# EAGLE design microcondsk (EAGLE 6.3)
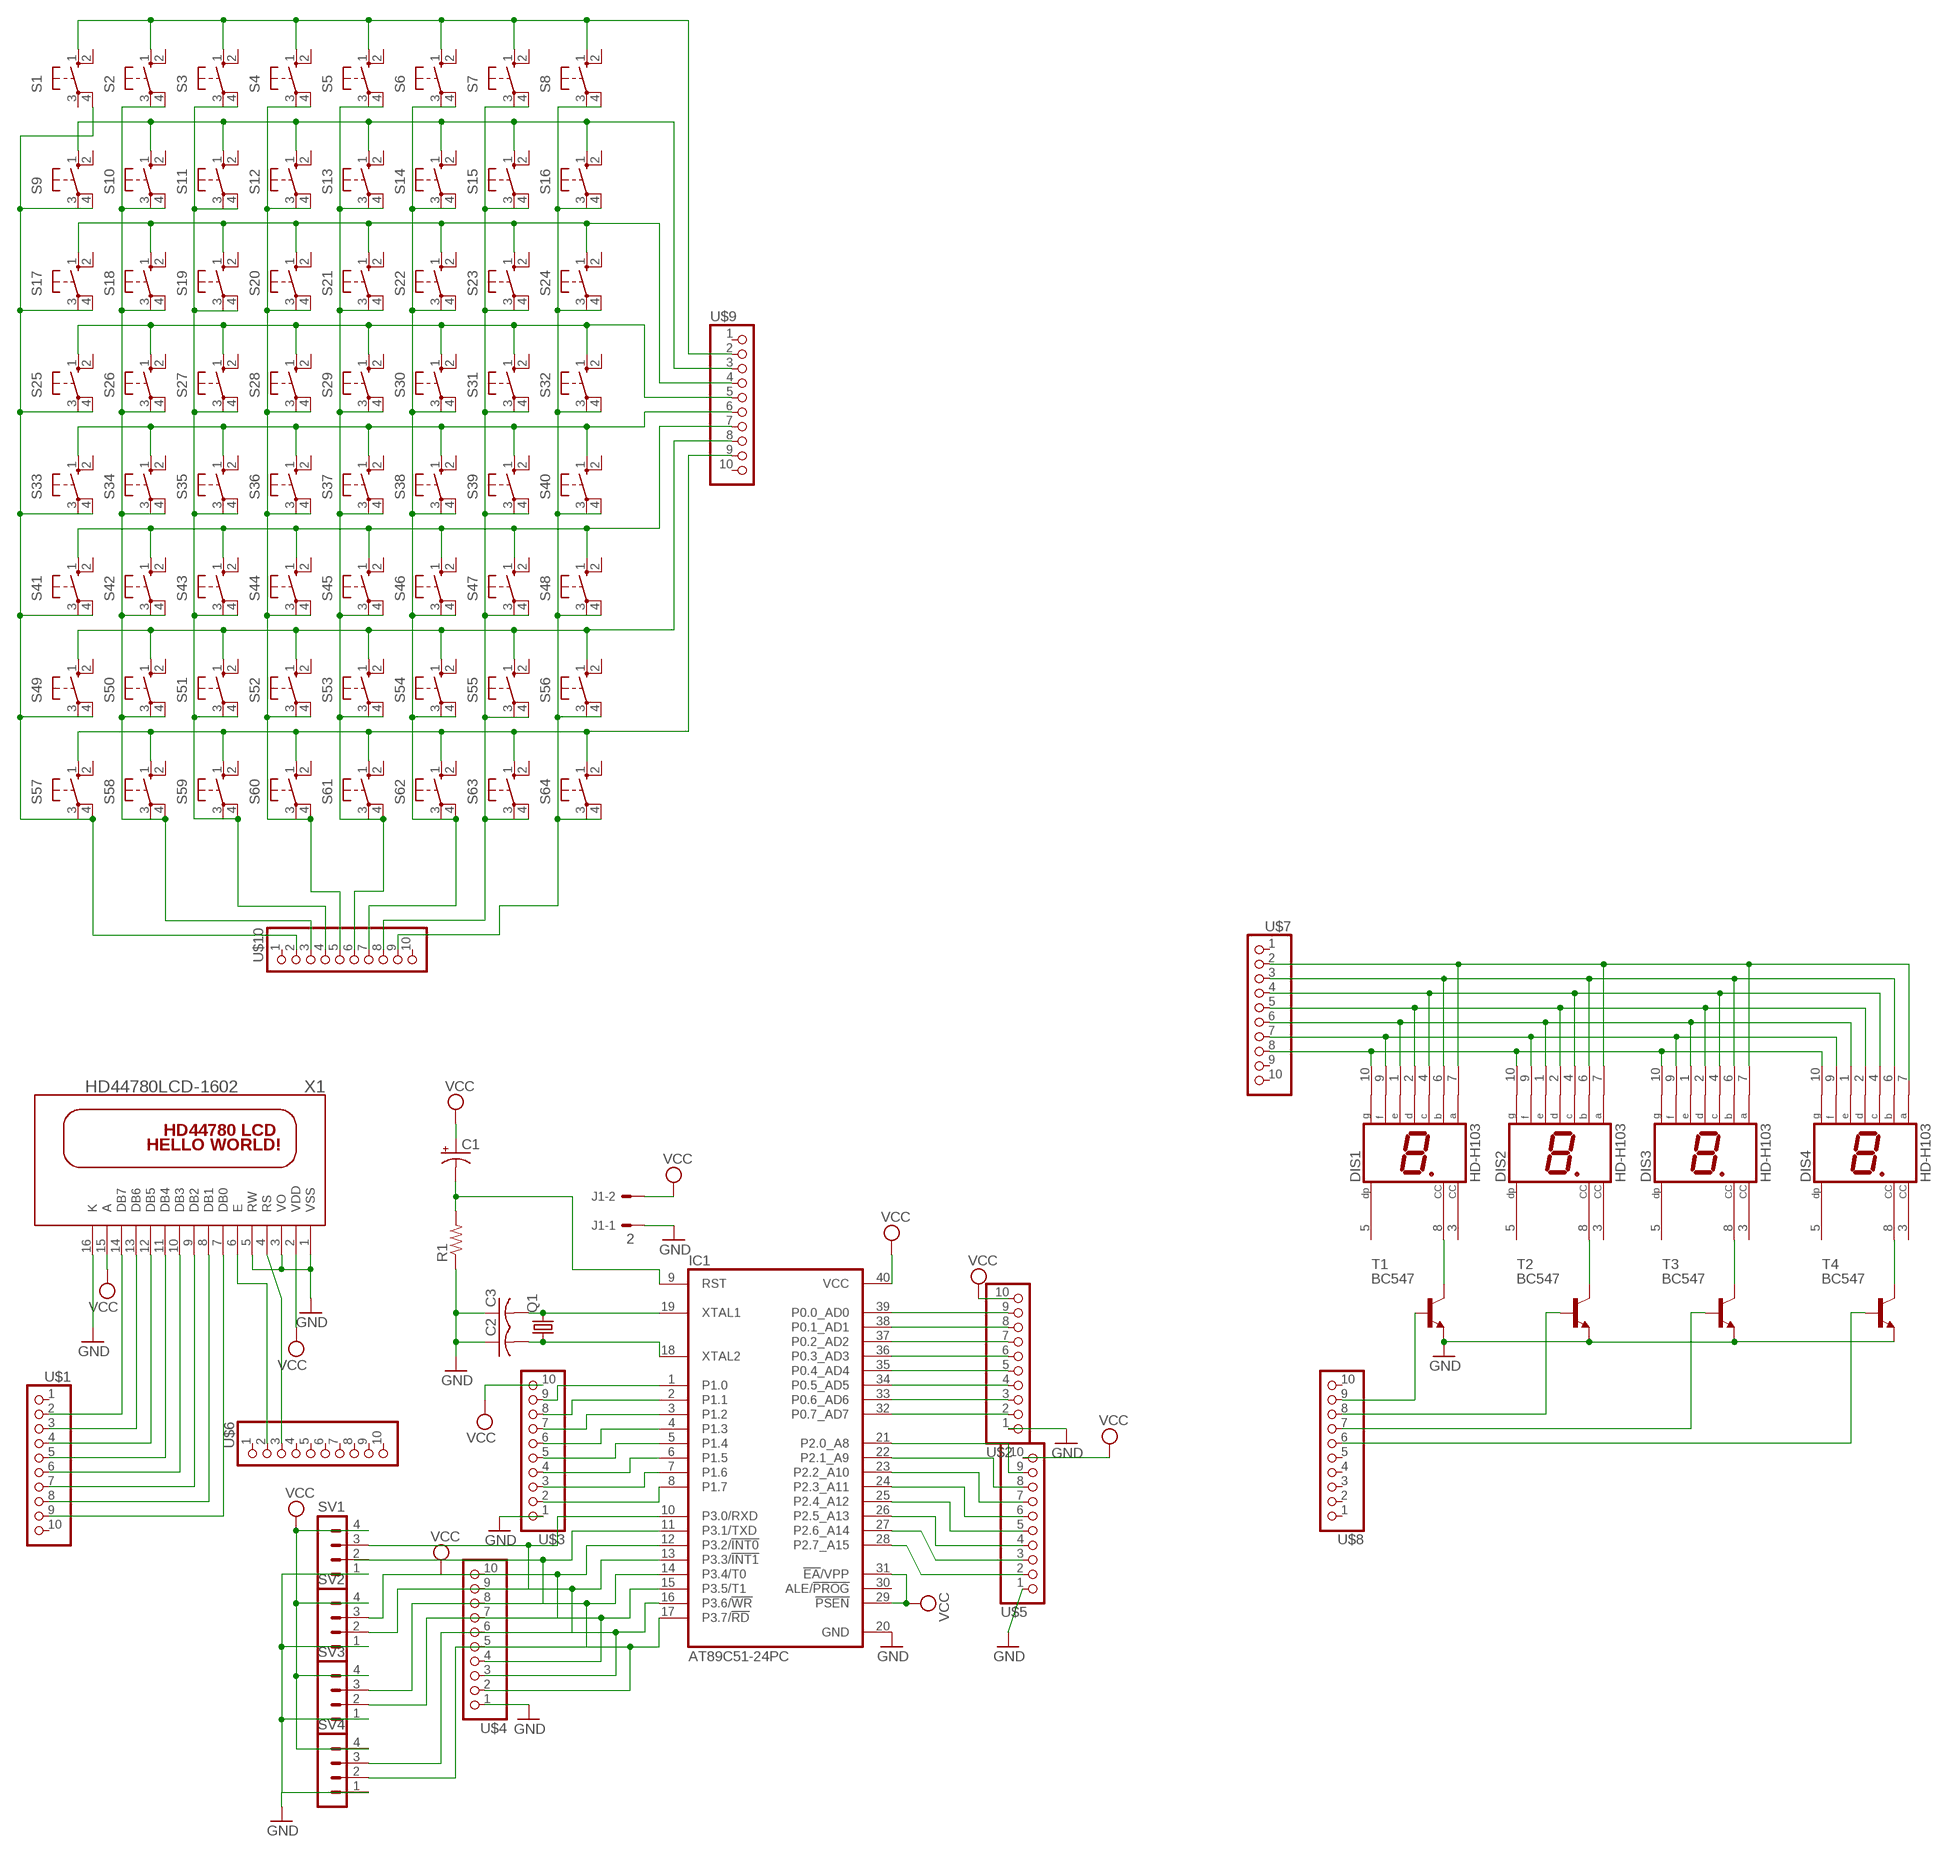
[diagram p0: schematic, sheet 1]

## Parts
C1  CPOL-USE2-5  [E2-5]
C2  C-US025-025X050  [C025-025X050]
C3  C-US025-025X050  [C025-025X050]
DIS1  HD-H103  [HDSP-M]
DIS2  HD-H103  [HDSP-M]
DIS3  HD-H103  [HDSP-M]
DIS4  HD-H103  [HDSP-M]
IC1  AT89C51-24PC  [DIL40]
J1  2  22-27-2021-02  [6410-02]
Q1  CRYSTALHC49U-V  [HC49U-V]
R1  R-US_0204/7  [0204/7]
S1  10-XX  [B3F-10XX]
S2  10-XX  [B3F-10XX]
S3  10-XX  [B3F-10XX]
S4  10-XX  [B3F-10XX]
S5  10-XX  [B3F-10XX]
S6  10-XX  [B3F-10XX]
S7  10-XX  [B3F-10XX]
S8  10-XX  [B3F-10XX]
S9  10-XX  [B3F-10XX]
S10  10-XX  [B3F-10XX]
S11  10-XX  [B3F-10XX]
S12  10-XX  [B3F-10XX]
S13  10-XX  [B3F-10XX]
S14  10-XX  [B3F-10XX]
S15  10-XX  [B3F-10XX]
S16  10-XX  [B3F-10XX]
S17  10-XX  [B3F-10XX]
S18  10-XX  [B3F-10XX]
S19  10-XX  [B3F-10XX]
S20  10-XX  [B3F-10XX]
S21  10-XX  [B3F-10XX]
S22  10-XX  [B3F-10XX]
S23  10-XX  [B3F-10XX]
S24  10-XX  [B3F-10XX]
S25  10-XX  [B3F-10XX]
S26  10-XX  [B3F-10XX]
S27  10-XX  [B3F-10XX]
S28  10-XX  [B3F-10XX]
S29  10-XX  [B3F-10XX]
S30  10-XX  [B3F-10XX]
S31  10-XX  [B3F-10XX]
S32  10-XX  [B3F-10XX]
S33  10-XX  [B3F-10XX]
S34  10-XX  [B3F-10XX]
S35  10-XX  [B3F-10XX]
S36  10-XX  [B3F-10XX]
S37  10-XX  [B3F-10XX]
S38  10-XX  [B3F-10XX]
S39  10-XX  [B3F-10XX]
S40  10-XX  [B3F-10XX]
S41  10-XX  [B3F-10XX]
S42  10-XX  [B3F-10XX]
S43  10-XX  [B3F-10XX]
S44  10-XX  [B3F-10XX]
S45  10-XX  [B3F-10XX]
S46  10-XX  [B3F-10XX]
S47  10-XX  [B3F-10XX]
S48  10-XX  [B3F-10XX]
S49  10-XX  [B3F-10XX]
S50  10-XX  [B3F-10XX]
S51  10-XX  [B3F-10XX]
S52  10-XX  [B3F-10XX]
S53  10-XX  [B3F-10XX]
S54  10-XX  [B3F-10XX]
S55  10-XX  [B3F-10XX]
S56  10-XX  [B3F-10XX]
S57  10-XX  [B3F-10XX]
S58  10-XX  [B3F-10XX]
S59  10-XX  [B3F-10XX]
S60  10-XX  [B3F-10XX]
S61  10-XX  [B3F-10XX]
S62  10-XX  [B3F-10XX]
S63  10-XX  [B3F-10XX]
S64  10-XX  [B3F-10XX]
SV1  MA04-1  [MA04-1]
SV2  MA04-1  [MA04-1]
SV3  MA04-1  [MA04-1]
SV4  MA04-1  [MA04-1]
T1  BC547  [TO92]
T2  BC547  [TO92]
T3  BC547  [TO92]
T4  BC547  [TO92]
U$1  PINHD-1X10  [1X10-BIG]
U$2  PINHD-1X10  [1X10-BIG]
U$3  PINHD-1X10  [1X10-BIG]
U$4  PINHD-1X10  [1X10-BIG]
U$5  PINHD-1X10  [1X10-BIG]
U$6  PINHD-1X10  [1X10-BIG]
U$7  PINHD-1X10  [1X10-BIG]
U$8  PINHD-1X10  [1X10-BIG]
U$9  PINHD-1X10  [1X10-BIG]
U$10  PINHD-1X10  [1X10-BIG]
X1  HD44780LCD-1602  [LCD1602]

## Nets
GND: C2.1 C3.1 IC1.20(GND) J1.1 R1.1 SV1.1 SV2.1 SV3.1 SV4.1 T1.1(E) T2.1(E) T3.1(E) T4.1(E) U$2.1 U$3.1 U$4.1 U$5.1 X1.1(VSS) X1.3(VO) X1.5(RW) X1.16(K)
N$1: IC1.8(P1.7) U$3.2
N$2: C1.- IC1.9(RST) R1.2
N$3: IC1.7(P1.6) U$3.3
N$4: C3.2 IC1.19(XTAL1) Q1.2
N$5: C2.2 IC1.18(XTAL2) Q1.1
N$6: IC1.6(P1.5) U$3.4
N$7: IC1.5(P1.4) U$3.5
N$8: IC1.4(P1.3) U$3.6
N$9: IC1.3(P1.2) U$3.7
N$10: IC1.2(P1.1) U$3.8
N$11: IC1.1(P1.0) U$3.9
N$12: IC1.10(P3.0/RXD) SV1.3 U$4.9
N$13: IC1.11(P3.1/TXD) SV1.2 U$4.8
N$14: IC1.12(P3.2/!INT0) SV2.3 U$4.7
N$15: IC1.13(P3.3/!INT1) SV2.2 U$4.6
N$16: DIS1.8(CC) T1.3(C)
N$17: IC1.15(P3.5/T1) SV3.2 U$4.4
N$18: IC1.16(P3.6/!WR) SV4.3 U$4.3
N$19: IC1.17(P3.7/!RD) SV4.2 U$4.2
N$20: IC1.32(P0.7_AD7) U$2.2
N$21: IC1.33(P0.6_AD6) U$2.3
N$22: IC1.34(P0.5_AD5) U$2.4
N$23: IC1.35(P0.4_AD4) U$2.5
N$24: IC1.36(P0.3_AD3) U$2.6
N$25: IC1.37(P0.2_AD2) U$2.7
N$26: IC1.38(P0.1_AD1) U$2.8
N$27: IC1.39(P0.0_AD0) U$2.9
N$28: IC1.21(P2.0_A8) U$5.9
N$29: IC1.22(P2.1_A9) U$5.8
N$30: IC1.23(P2.2_A10) U$5.7
N$31: IC1.24(P2.3_A11) U$5.6
N$32: IC1.25(P2.4_A12) U$5.5
N$33: IC1.26(P2.5_A13) U$5.4
N$34: IC1.28(P2.7_A15) U$5.2
N$35: IC1.27(P2.6_A14) U$5.3
N$36: U$1.2 X1.14(DB7)
N$37: U$1.3 X1.13(DB6)
N$38: U$1.4 X1.12(DB5)
N$39: U$1.5 X1.11(DB4)
N$40: U$1.6 X1.10(DB3)
N$41: U$1.7 X1.9(DB2)
N$42: U$1.8 X1.8(DB1)
N$43: U$1.9 X1.7(DB0)
N$44: U$6.2 X1.6(E)
N$45: U$6.3 X1.4(RS)
N$46: DIS2.8(CC) T2.3(C)
N$47: IC1.14(P3.4/T0) SV3.3 U$4.5
N$48: DIS3.8(CC) T3.3(C)
N$49: DIS4.8(CC) T4.3(C)
N$50: T1.2(B) U$8.9
N$51: S1.1(S) S2.1(S) S3.1(S) S4.1(S) S5.1(S) S6.1(S) S7.1(S) S8.1(S) U$9.2
N$52: T4.2(B) U$8.6
N$53: T3.2(B) U$8.7
N$54: DIS1.10(G) DIS2.10(G) DIS3.10(G) DIS4.10(G) U$7.8
N$55: DIS1.9(F) DIS2.9(F) DIS3.9(F) DIS4.9(F) U$7.7
N$56: DIS1.1(E) DIS2.1(E) DIS3.1(E) DIS4.1(E) U$7.6
N$57: DIS1.2(D) DIS2.2(D) DIS3.2(D) DIS4.2(D) U$7.5
N$58: DIS1.4(C) DIS2.4(C) DIS3.4(C) DIS4.4(C) U$7.4
N$59: DIS1.6(B) DIS2.6(B) DIS3.6(B) DIS4.6(B) U$7.3
N$60: DIS1.7(A) DIS2.7(A) DIS3.7(A) U$7.2
N$61: T2.2(B) U$8.8
N$62: S9.1(S) S10.1(S) S11.1(S) S12.1(S) S13.1(S) S14.1(S) S15.1(S) S16.1(S) U$9.3
N$63: S1.4(P1) S9.4(P1) S17.4(P1) S25.4(P1) S33.4(P1) S41.4(P1) S49.4(P1) S57.4(P1) U$10.2
N$64: S2.4(P1) S10.4(P1) S18.4(P1) S26.4(P1) S34.4(P1) S42.4(P1) S50.4(P1) S58.4(P1) U$10.3
N$65: S3.4(P1) S11.4(P1) S19.4(P1) S27.4(P1) S35.4(P1) S43.4(P1) S51.4(P1) S59.4(P1) U$10.4
N$67: S4.4(P1) S12.4(P1) S20.4(P1) S28.4(P1) S36.4(P1) S44.4(P1) S52.4(P1) S60.4(P1) U$10.5
N$68: S5.4(P1) S13.4(P1) S21.4(P1) S29.4(P1) S37.4(P1) S45.4(P1) S53.4(P1) S61.4(P1) U$10.6
N$69: S6.4(P1) S14.4(P1) S22.4(P1) S30.4(P1) S38.4(P1) S46.4(P1) S54.4(P1) S62.4(P1) U$10.7
N$70: S7.4(P1) S15.4(P1) S23.4(P1) S31.4(P1) S39.4(P1) S47.4(P1) S55.4(P1) S63.4(P1) U$10.8
N$71: S8.4(P1) S16.4(P1) S24.4(P1) S32.4(P1) S40.4(P1) S48.4(P1) S56.4(P1) S64.4(P1) U$10.9
N$72: S17.1(S) S18.1(S) S19.1(S) S20.1(S) S21.1(S) S22.1(S) S23.1(S) S24.1(S) U$9.4
N$73: S25.1(S) S26.1(S) S27.1(S) S28.1(S) S29.1(S) S30.1(S) S31.1(S) S32.1(S) U$9.5
N$74: S33.1(S) S34.1(S) S35.1(S) S36.1(S) S37.1(S) S38.1(S) S39.1(S) S40.1(S) U$9.6
N$75: S41.1(S) S42.1(S) S43.1(S) S44.1(S) S45.1(S) S46.1(S) S47.1(S) S48.1(S) U$9.7
N$77: S49.1(S) S50.1(S) S51.1(S) S52.1(S) S53.1(S) S54.1(S) S55.1(S) S56.1(S) U$9.8
N$78: S57.1(S) S58.1(S) S59.1(S) S60.1(S) S61.1(S) S62.1(S) S63.1(S) S64.1(S) U$9.9
VCC: C1.+ IC1.29(!PSEN) IC1.31(!EA!/VPP) IC1.40(VCC) J1.2 SV1.4 SV2.4 SV3.4 SV4.4 U$2.10 U$3.10 U$4.10 U$5.10 X1.2(VDD) X1.15(A)
Unconnected: DIS1.3(CC) DIS1.5(DP) DIS2.3(CC) DIS2.5(DP) DIS3.3(CC) DIS3.5(DP) DIS4.3(CC) DIS4.5(DP) DIS4.7(A) IC1.30(ALE/!PROG) S1.2(S1) S1.3(P) S2.2(S1) S2.3(P) S3.2(S1) S3.3(P) S4.2(S1) S4.3(P) S5.2(S1) S5.3(P) S6.2(S1) S6.3(P) S7.2(S1) S7.3(P) S8.2(S1) S8.3(P) S9.2(S1) S9.3(P) S10.2(S1) S10.3(P) S11.2(S1) S11.3(P) S12.2(S1) S12.3(P) S13.2(S1) S13.3(P) S14.2(S1) S14.3(P) S15.2(S1) S15.3(P) S16.2(S1) S16.3(P) S17.2(S1) S17.3(P) S18.2(S1) S18.3(P) S19.2(S1) S19.3(P) S20.2(S1) S20.3(P) S21.2(S1) S21.3(P) S22.2(S1) S22.3(P) S23.2(S1) S23.3(P) S24.2(S1) S24.3(P) S25.2(S1) S25.3(P) S26.2(S1) S26.3(P) S27.2(S1) S27.3(P) S28.2(S1) S28.3(P) S29.2(S1) S29.3(P) S30.2(S1) S30.3(P) S31.2(S1) S31.3(P) S32.2(S1) S32.3(P) S33.2(S1) S33.3(P) S34.2(S1) S34.3(P) S35.2(S1) S35.3(P) S36.2(S1) S36.3(P) S37.2(S1) S37.3(P) S38.2(S1) S38.3(P) S39.2(S1) S39.3(P) S40.2(S1) S40.3(P) S41.2(S1) S41.3(P) S42.2(S1) S42.3(P) S43.2(S1) S43.3(P) S44.2(S1) S44.3(P) S45.2(S1) S45.3(P) S46.2(S1) S46.3(P) S47.2(S1) S47.3(P) S48.2(S1) S48.3(P) S49.2(S1) S49.3(P) S50.2(S1) S50.3(P) S51.2(S1) S51.3(P) S52.2(S1) S52.3(P) S53.2(S1) S53.3(P) S54.2(S1) S54.3(P) S55.2(S1) S55.3(P) S56.2(S1) S56.3(P) S57.2(S1) S57.3(P) S58.2(S1) S58.3(P) S59.2(S1) S59.3(P) S60.2(S1) S60.3(P) S61.2(S1) S61.3(P) S62.2(S1) S62.3(P) S63.2(S1) S63.3(P) S64.2(S1) S64.3(P) U$1.1 U$1.10 U$6.1 U$6.4 U$6.5 U$6.6 U$6.7 U$6.8 U$6.9 U$6.10 U$7.1 U$7.9 U$7.10 U$8.1 U$8.2 U$8.3 U$8.4 U$8.5 U$8.10 U$9.1 U$9.10 U$10.1 U$10.10

## Library data of the parts
C1 = adafruit:CPOL-US: POLARIZED CAPACITOR, American symbol
C2 C3 = adafruit:C-US: CAPACITOR, American symbol
DIS1-DIS4 = display-hp:HD-H103: LED DISPLAY 1-character 7 segment, decimal point right; OC_FARNELL: unknown; OC_NEWARK: unknown
IC1 = atmel:AT89C51-*: 8-bit Microcontroller with 4K Bytes Flash Not Recommended for New Designs. Use AT89S51. Source: http://www.atmel.com/dyn/resources/prod_documents/doc0265.; OC_FARNELL: unknown; OC_NEWARK: unknown
J1 = con-molex:22-?-02: CONNECTOR wire to board 2.54 mm (.1 inch) pitch header; OC_FARNELL: unknown; OC_NEWARK: unknown
Q1 = crystal:CRYSTAL: CRYSTAL; OC_FARNELL: 1666969; OC_NEWARK: unknown
R1 = adafruit:R-US_: RESISTOR, American symbol
S1-S64 = switch-omron:10-XX: OMRON SWITCH; MPN: B3F-1000; OC_FARNELL: 176432; OC_NEWARK: 36M3542
SV1-SV4 = con-lstb:MA04-1: PIN HEADER; OC_FARNELL: unknown; OC_NEWARK: unknown
T1-T4 = transistor:BC547: NPN TRANSISTOR
U$1-U$10 = adafruit:PINHD-1X10: Pin header 1x10 0.1" spacing With round pins
X1 = adafruit:HD44780LCD: HD44780 LCD Standard character type LCDs, available in sizes from 8x1 to 40x4!

## Net classes
0 default: width 0.508 mm, drill 0.508 mm, clearance 0.635 mm

## Board
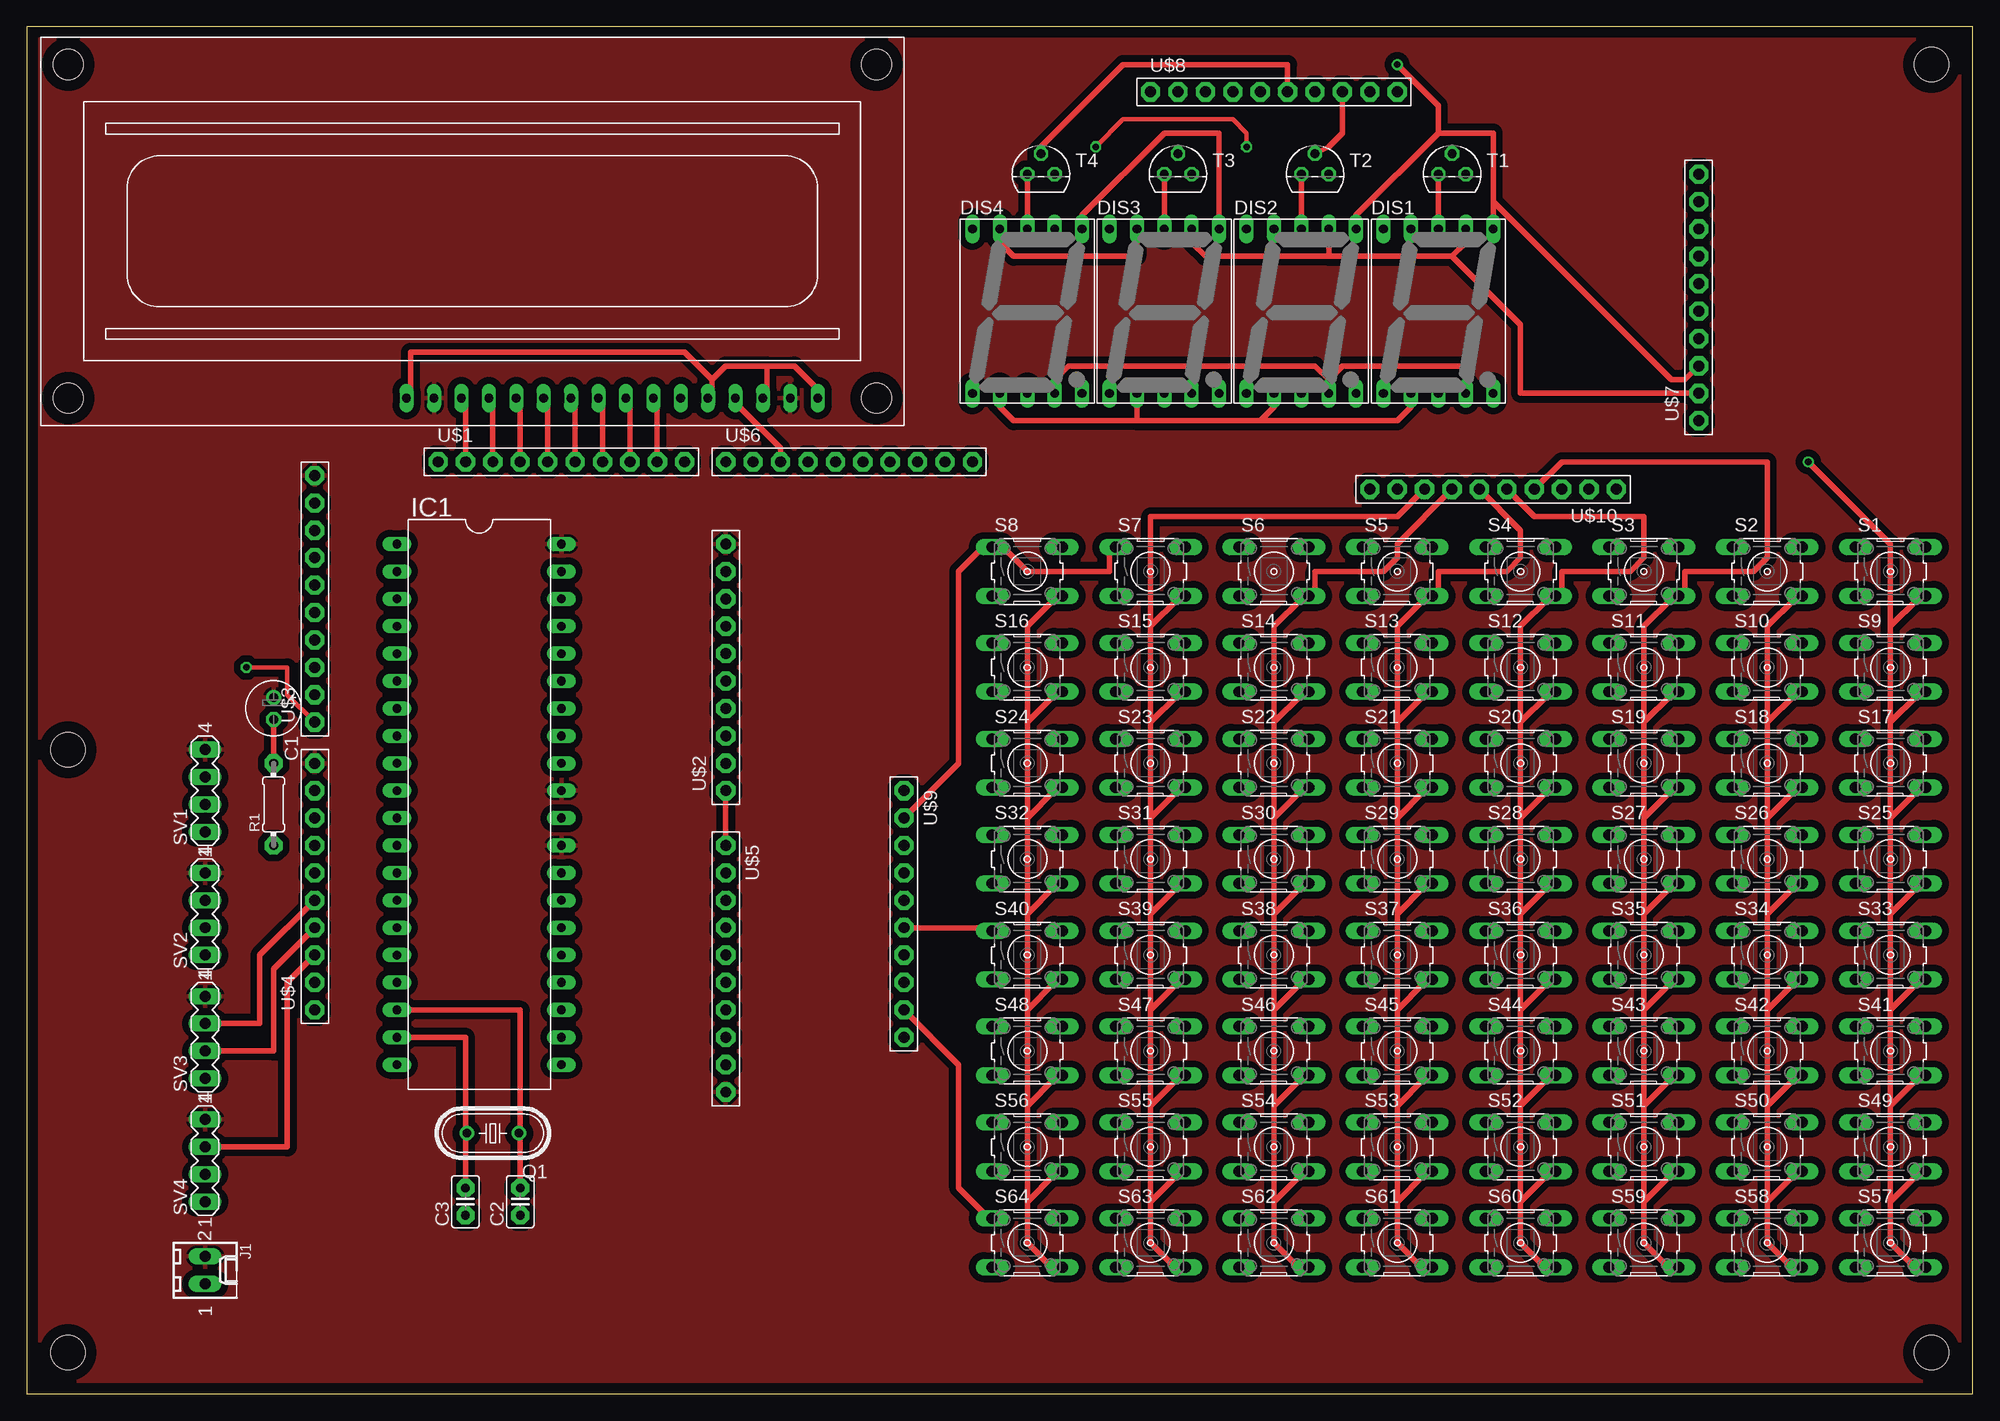
[diagram p1: board, top side]
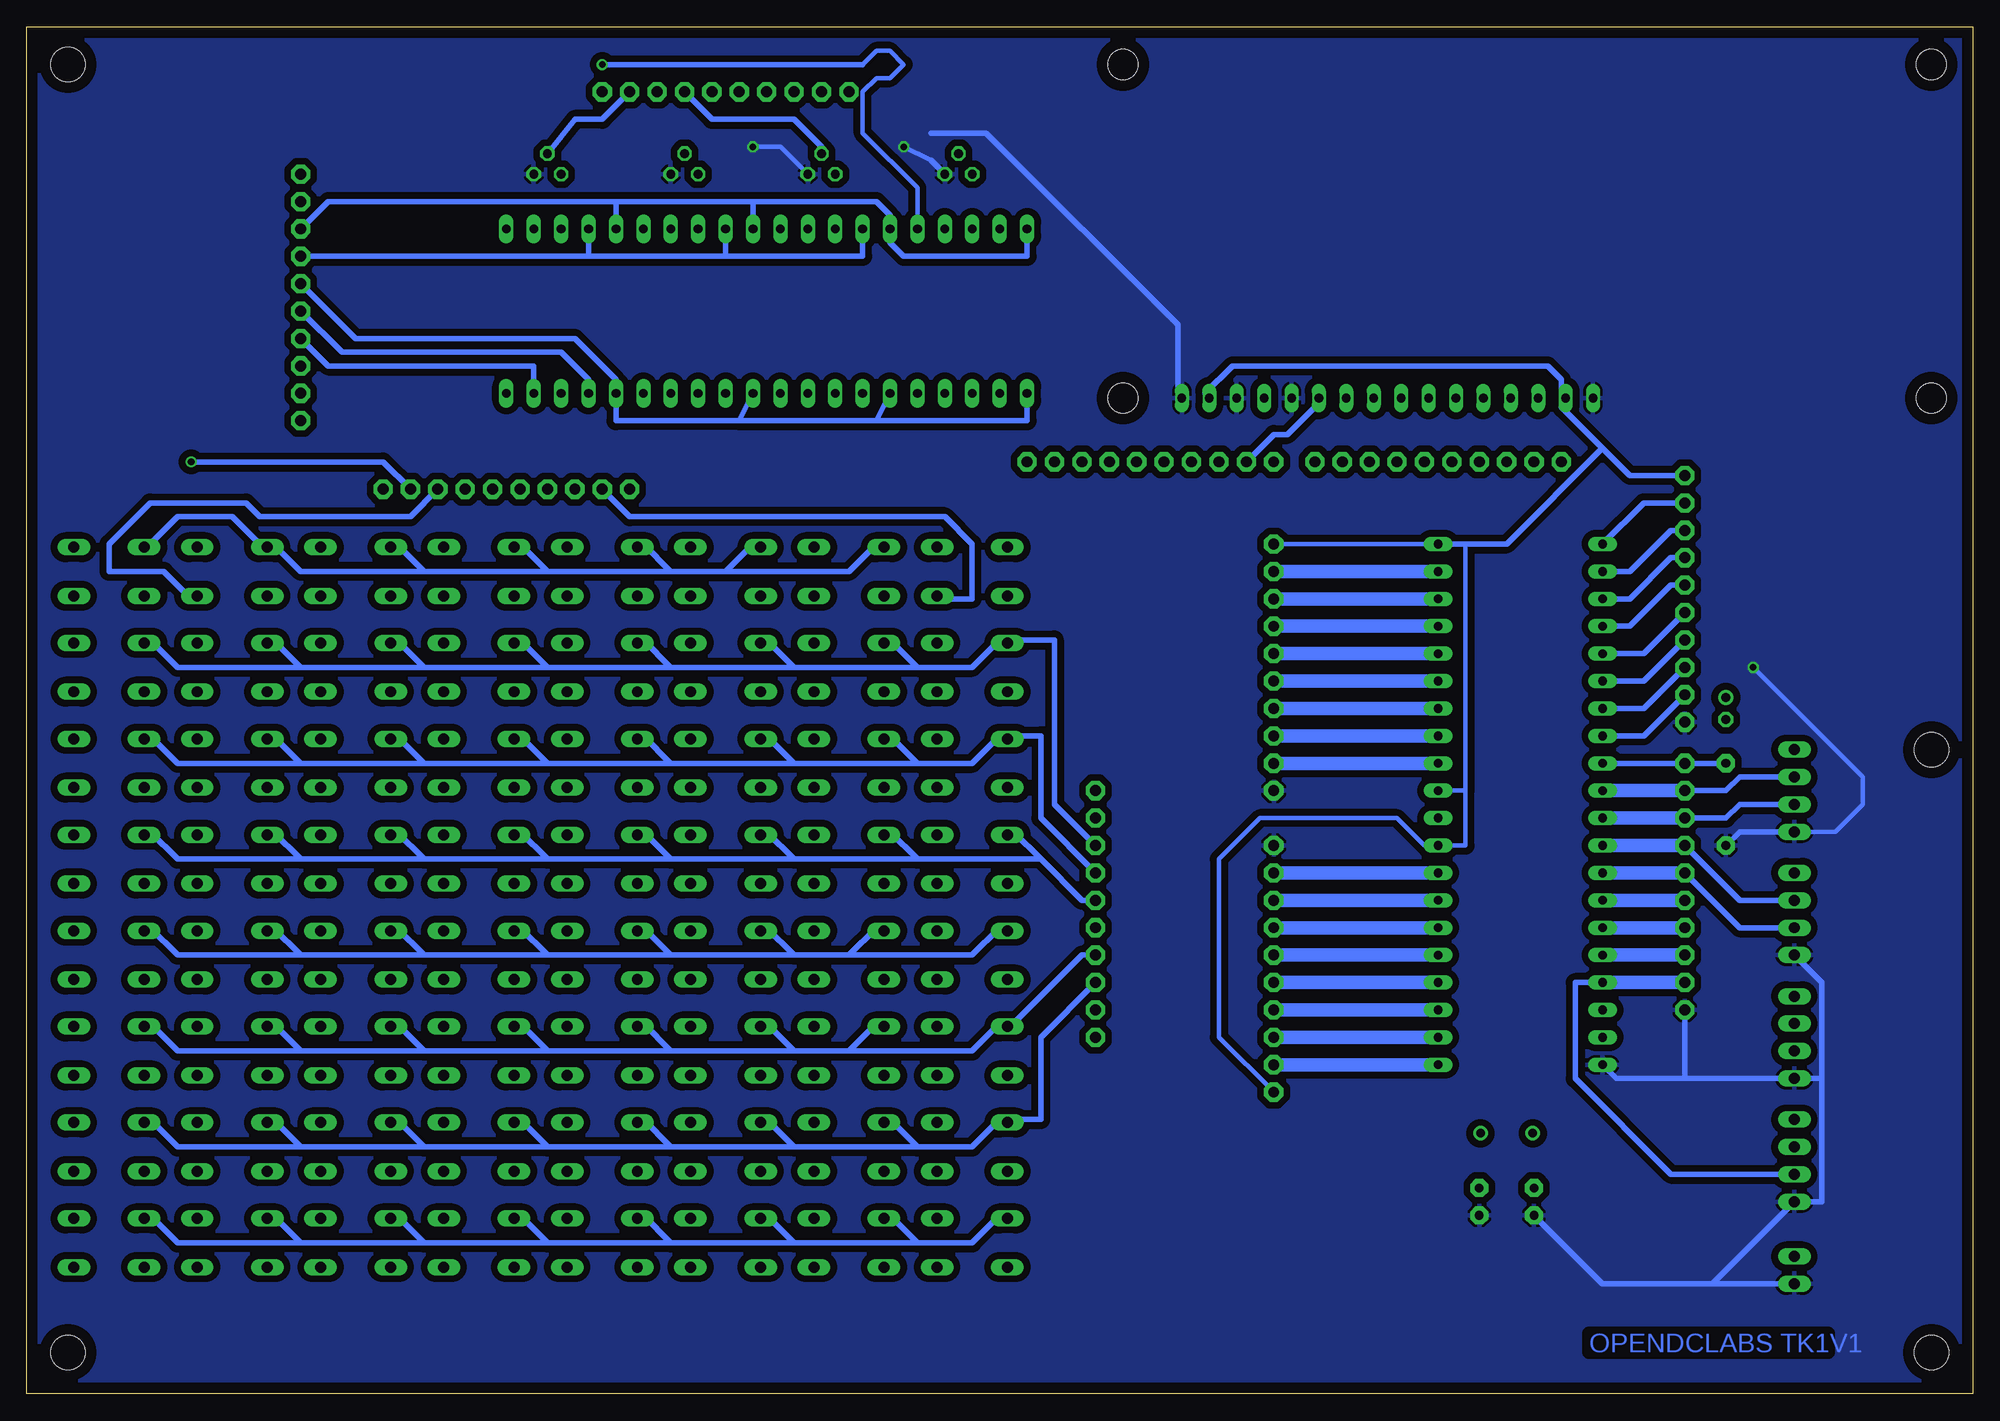
[diagram p2: board, bottom side, seen from below]

Size 180.32 x 126.67 mm. Coordinates in mm from the lower left corner, seen from the top.
Outline: 0,0 180.32,0 180.32,126.67 0,126.67 0,0
Copper layers (1*16): Top 0.035mm / dielectric 1.5mm / Bottom 0.035mm
Design rules "default": minimum track width 10mil, minimum drill 24mil, track to track 8mil, track to pad 8mil, pad to pad 8mil, via to via 8mil, smd to smd 8mil, copper to edge 40mil, drill to drill 8mil, minimum pad ring 10mil, minimum via ring 8mil, stop-mask expansion 4mil, vias tented up to drill 0mil, thermal gap 10mil
Holes 3.2 mm at 176.53,123.19 176.53,3.81 3.81,59.69 3.81,3.81

### Footprints (pad centres in the part's own frame; a part is rotated, then mirrored left to right if it is on the bottom)
E2-5 = drill 0.813 pad 1.422: + -1.016,0 | drill 0.813 pad 1.422 octagon: - 1.016,0
C025-025X050 = drill 0.813 pad 1.676 octagon: 1 -1.27,0; 2 1.27,0
HDSP-M = drill 0.813 long: 1 -5.08,-7.62; 2 -2.54,-7.62; 3 0,-7.62; 4 2.54,-7.62; 5 5.08,-7.62; 6 5.08,7.62; 7 2.54,7.62; 8 0,7.62; 9 -2.54,7.62; 10 -5.08,7.62
DIL40 = drill 0.813 long: 1 -24.13,-7.62; 2 -21.59,-7.62; 3 -19.05,-7.62; 4 -16.51,-7.62; 5 -13.97,-7.62; 6 -11.43,-7.62; 7 -8.89,-7.62; 8 -6.35,-7.62; 9 -3.81,-7.62; 10 -1.27,-7.62; 11 1.27,-7.62; 12 3.81,-7.62; 13 6.35,-7.62; 14 8.89,-7.62; 15 11.43,-7.62; 16 13.97,-7.62; 17 16.51,-7.62; 18 19.05,-7.62; 19 21.59,-7.62; 20 24.13,-7.62; 21 24.13,7.62; 22 21.59,7.62; 23 19.05,7.62; 24 16.51,7.62; 25 13.97,7.62; 26 11.43,7.62; 27 8.89,7.62; 28 6.35,7.62; 29 3.81,7.62; 30 1.27,7.62; 31 -1.27,7.62; 32 -3.81,7.62; 33 -6.35,7.62; 34 -8.89,7.62; 35 -11.43,7.62; 36 -13.97,7.62; 37 -16.51,7.62; 38 -19.05,7.62; 39 -21.59,7.62; 40 -24.13,7.62
6410-02 = drill 1.016 long: 1 1.27,0; 2 -1.27,0
HC49U-V = drill 0.813: 1 -2.413,0; 2 2.413,0
0204/7 = drill 0.813 pad 1.676 octagon: 1 -3.81,0; 2 3.81,0
B3F-10XX = drill 1.016 long: 1 -3.251,2.261; 2 3.251,2.261; 3 -3.251,-2.261; 4 3.251,-2.261
MA04-1 = drill 1.016 long: 1 -3.81,0; 2 -1.27,0; 3 1.27,0; 4 3.81,0
TO92 = drill 0.813 octagon: 1 1.27,0; 2 0,1.905; 3 -1.27,0
1X10-BIG = drill 1.016 pad 1.778 octagon: 1 -11.43,0; 2 -8.89,0; 3 -6.35,0; 4 -3.81,0; 5 -1.27,0; 6 1.27,0; 7 3.81,0; 8 6.35,0; 9 8.89,0; 10 11.43,0
LCD1602 = drill 0.8 long: 1 8,33.46; 2 10.54,33.46; 3 13.08,33.46; 4 15.62,33.46; 5 18.16,33.46; 6 20.7,33.46; 7 23.24,33.46; 8 25.78,33.46; 9 28.32,33.46; 10 30.86,33.46; 11 33.4,33.46; 12 35.94,33.46; 13 38.48,33.46; 14 41.02,33.46; 15 43.56,33.46; 16 46.1,33.46 | hole 2.8: 2.54,2.54; 2.54,33.46; 77.46,33.46; 77.46,2.54

### Placement (x,y rotation side)
C1  22.86,63.5 270 top
C2  45.72,17.78 90 top
C3  40.64,17.78 90 top
DIS1  130.81,100.33 0 top
DIS2  118.11,100.33 0 top
DIS3  105.41,100.33 0 top
DIS4  92.71,100.33 0 top
IC1  41.91,54.61 270 top
J1  16.51,11.43 270 top
Q1  43.18,24.13 180 top
R1  22.86,54.61 90 top
S1  172.72,76.2 0 top
S2  161.29,76.2 0 top
S3  149.86,76.2 0 top
S4  138.43,76.2 0 top
S5  127,76.2 0 top
S6  115.57,76.2 0 top
S7  104.14,76.2 0 top
S8  92.71,76.2 0 top
S9  172.72,67.31 0 top
S10  161.29,67.31 0 top
S11  149.86,67.31 0 top
S12  138.43,67.31 0 top
S13  127,67.31 0 top
S14  115.57,67.31 0 top
S15  104.14,67.31 0 top
S16  92.71,67.31 0 top
S17  172.72,58.42 0 top
S18  161.29,58.42 0 top
S19  149.86,58.42 0 top
S20  138.43,58.42 0 top
S21  127,58.42 0 top
S22  115.57,58.42 0 top
S23  104.14,58.42 0 top
S24  92.71,58.42 0 top
S25  172.72,49.53 0 top
S26  161.29,49.53 0 top
S27  149.86,49.53 0 top
S28  138.43,49.53 0 top
S29  127,49.53 0 top
S30  115.57,49.53 0 top
S31  104.14,49.53 0 top
S32  92.71,49.53 0 top
S33  172.72,40.64 0 top
S34  161.29,40.64 0 top
S35  149.86,40.64 0 top
S36  138.43,40.64 0 top
S37  127,40.64 0 top
S38  115.57,40.64 0 top
S39  104.14,40.64 0 top
S40  92.71,40.64 0 top
S41  172.72,31.75 0 top
S42  161.29,31.75 0 top
S43  149.86,31.75 0 top
S44  138.43,31.75 0 top
S45  127,31.75 0 top
S46  115.57,31.75 0 top
S47  104.14,31.75 0 top
S48  92.71,31.75 0 top
S49  172.72,22.86 0 top
S50  161.29,22.86 0 top
S51  149.86,22.86 0 top
S52  138.43,22.86 0 top
S53  127,22.86 0 top
S54  115.57,22.86 0 top
S55  104.14,22.86 0 top
S56  92.71,22.86 0 top
S57  172.72,13.97 0 top
S58  161.29,13.97 0 top
S59  149.86,13.97 0 top
S60  138.43,13.97 0 top
S61  127,13.97 0 top
S62  115.57,13.97 0 top
S63  104.14,13.97 0 top
S64  92.71,13.97 0 top
SV1  16.51,55.88 90 top
SV2  16.51,44.45 90 top
SV3  16.51,33.02 90 top
SV4  16.51,21.59 90 top
T1  132.08,113.03 0 top
T2  119.38,113.03 0 top
T3  106.68,113.03 0 top
T4  93.98,113.03 0 top
U$1  49.53,86.36 0 top
U$2  64.77,67.31 90 top
U$3  26.67,73.66 90 top
U$4  26.67,46.99 90 top
U$5  64.77,39.37 270 top
U$6  76.2,86.36 0 top
U$7  154.94,101.6 90 top
U$8  115.57,120.65 0 top
U$9  81.28,44.45 270 top
U$10  135.89,83.82 180 top
X1  81.28,125.73 180 top

### Tracks (layer width: path | path; a pad name or v marks a point on that pad's centre or on a via)
GND  (via drill 0.6)
  Top 0.406: v99.06,115.57 101.6,118.11 111.76,118.11 113.03,116.84 v113.03,115.57 | v20.32,67.31 24.13,67.31 24.13,64.77 U$3.1
  Top 0.508: U$2.1 U$5.1 | 63.5,93.98 63.5,92.71 X1.5 | 63.5,93.98 64.77,95.25 68.58,95.25 | 68.58,95.25 68.58,92.71 X1.3 | 68.58,95.25 71.12,95.25 73.66,92.71 X1.1 | 63.5,93.98 60.96,96.52 35.56,96.52 35.56,92.71 X1.16
  Bottom 0.406: 96.52,114.3 v99.06,115.57 | v113.03,115.57 110.49,115.57 T3.1 | SV1.1 12.7,52.07 10.16,54.61 10.16,57.15 v20.32,67.31
  Bottom 0.508: R1.1 21.59,52.07 SV1.1 | IC1.20 33.02,29.21 26.67,29.21 | 26.67,29.21 SV3.1 13.97,29.21 | 26.67,29.21 U$4.1 | SV2.1 13.97,38.1 13.97,29.21 | 24.13,10.16 34.29,10.16 C3.1 | 24.13,10.16 J1.1 | 24.13,10.16 SV4.1 13.97,17.78 13.97,29.21 | 96.52,114.3 T4.1 | 96.52,116.84 91.44,116.84 73.66,99.06 73.66,92.71 X1.1
  pour Bottom: -1.27,128.27 182.88,128.27 182.88,-2.54 -1.27,-2.54 -1.27,127
N$1
  Bottom 0.508: IC1.8 30.48,60.96 U$3.2
N$2
  Top 0.508: R1.2 C1.-
  Bottom 0.508: R1.2 IC1.9
N$3
  Bottom 0.508: IC1.7 30.48,63.5 U$3.3
N$4
  Top 0.508: C3.2 40.64,24.13 | IC1.19 40.64,33.02 40.64,24.13 | 40.64,24.13 Q1.2
N$5
  Top 0.508: C2.2 45.72,24.13 | IC1.18 45.72,35.56 45.72,24.13 | 45.72,24.13 Q1.1
N$6
  Bottom 0.508: IC1.6 30.48,66.04 U$3.4
N$7
  Bottom 0.508: IC1.5 30.48,68.58 U$3.5
N$8
  Bottom 0.508: IC1.4 31.75,71.12 27.94,74.93 U$3.6
N$9
  Bottom 0.508: IC1.3 31.75,73.66 27.94,77.47 U$3.7
N$10
  Bottom 0.508: IC1.2 31.75,76.2 27.94,80.01 U$3.8
N$11
  Bottom 0.508: IC1.1 30.48,82.55 U$3.9
N$12
  Bottom 0.508: SV1.3 21.59,57.15 22.86,55.88 U$4.9
  Bottom 1.27: U$4.9 IC1.10
N$13
  Bottom 0.508: SV1.2 21.59,54.61 22.86,53.34 U$4.8
  Bottom 1.27: IC1.11 U$4.8
N$14
  Bottom 0.508: SV2.3 21.59,45.72 U$4.7
  Bottom 1.27: U$4.7 IC1.12
N$15
  Bottom 0.508: SV2.2 21.59,43.18 U$4.6
  Bottom 1.27: IC1.13 U$4.6
N$16
  Top 0.508: T1.3 DIS1.8
N$17
  Top 0.508: SV3.2 22.86,31.75 22.86,39.37 U$4.4
  Bottom 1.27: IC1.15 U$4.4
N$18
  Top 0.508: SV4.3 24.13,22.86 24.13,38.1 U$4.3
  Bottom 1.27: U$4.3 IC1.16
N$19
  Bottom 0.508: SV4.2 27.94,20.32 36.83,29.21 36.83,38.1 IC1.17
  Bottom 1.27: U$4.2 IC1.17
N$20
  Bottom 1.27: IC1.32 U$2.2
N$21
  Bottom 1.27: U$2.3 IC1.33
N$22
  Bottom 1.27: U$2.4 IC1.34
N$23
  Bottom 1.27: IC1.35 U$2.5
N$24
  Bottom 1.27: U$2.6 IC1.36
N$25
  Bottom 1.27: IC1.37 U$2.7
N$26
  Bottom 1.27: U$2.8 IC1.38
N$27
  Bottom 1.27: IC1.39 U$2.9
N$28
  Bottom 1.27: U$5.9 IC1.21
N$29
  Bottom 1.27: IC1.22 U$5.8
N$30
  Bottom 1.27: U$5.7 IC1.23
N$31
  Bottom 1.27: IC1.24 U$5.6
N$32
  Bottom 1.27: U$5.5 IC1.25
N$33
  Bottom 1.27: IC1.26 U$5.4
N$34
  Bottom 1.27: IC1.28 U$5.2
N$35
  Bottom 1.27: U$5.3 IC1.27
N$36
  Top 0.508: U$1.2 40.64,91.44 X1.14
N$37
  Top 0.508: U$1.3 43.18,91.44 X1.13
N$38
  Top 0.508: U$1.4 45.72,91.44 X1.12
N$39
  Top 0.508: U$1.5 48.26,91.44 X1.11
N$40
  Top 0.508: U$1.6 50.8,91.44 X1.10
N$41
  Top 0.508: U$1.7 53.34,91.44 X1.9
N$42
  Top 0.508: U$1.8 55.88,91.44 X1.8
N$43
  Top 0.508: U$1.9 58.42,91.44 X1.7
N$44
  Bottom 0.508: U$6.2 64.77,88.9 63.5,88.9 60.96,91.44 X1.6
N$45
  Top 0.508: U$6.3 69.85,87.63 66.04,91.44 X1.4
N$46
  Top 0.508: T2.3 DIS2.8
N$47
  Top 0.508: SV3.3 21.59,34.29 21.59,40.64 U$4.5
  Bottom 1.27: IC1.14 U$4.5
N$48
  Top 0.508: T3.3 DIS3.8
N$49
  Top 0.508: T4.3 DIS4.8
N$50
  Bottom 0.508: U$8.9 127,118.11 129.54,118.11 T1.2
N$51
  Top 0.508: S7.1 100.33,78.74 100.33,76.2 92.71,76.2 90.17,78.74 S8.1 88.9,78.74 86.36,76.2 86.36,58.42 U$9.2
  Bottom 0.508: 115.57,76.2 113.03,78.74 S6.1 | 120.65,76.2 115.57,76.2 | 120.65,76.2 123.19,78.74 S5.1 | 132.08,76.2 134.62,78.74 S4.1 | 120.65,76.2 132.08,76.2 | 143.51,76.2 146.05,78.74 S3.1 | 132.08,76.2 143.51,76.2 | 143.51,76.2 154.94,76.2 157.48,78.74 S2.1 158.75,78.74 161.29,81.28 166.37,81.28 168.91,78.74 S1.1 | 115.57,76.2 104.14,76.2 101.6,78.74 S7.1
N$52
  Top 0.508: U$8.6 116.84,123.19 101.6,123.19 93.98,115.57 T4.2
N$53
  Bottom 0.508: U$8.7 116.84,118.11 109.22,118.11 106.68,115.57 T3.2
N$54
  Bottom 0.508: DIS4.10 87.63,105.41 99.06,105.41 100.33,106.68 DIS3.10 100.33,109.22 101.6,110.49 113.03,110.49 | 113.03,110.49 DIS2.10 | 125.73,110.49 DIS1.10 | 113.03,110.49 125.73,110.49 | U$7.8 152.4,110.49 125.73,110.49
N$55
  Top 0.508: DIS4.9 90.17,106.68 91.44,105.41 102.87,105.41 DIS3.9
  Bottom 0.508: 115.57,105.41 DIS2.9 | U$7.7 128.27,105.41 | 128.27,105.41 115.57,105.41 | 128.27,105.41 DIS1.9 | DIS3.9 102.87,105.41 115.57,105.41
N$56
  Bottom 0.508: 114.3,90.17 DIS2.1 | 101.6,90.17 DIS3.1 | 114.3,90.17 101.6,90.17 | DIS4.1 87.63,90.17 101.6,90.17 | 114.3,90.17 125.73,90.17 DIS1.1 125.73,93.98 129.54,97.79 149.86,97.79 U$7.6
N$57
  Top 0.508: DIS4.2 90.17,91.44 91.44,90.17 102.87,90.17 | DIS3.2 102.87,90.17 | DIS2.2 115.57,91.44 114.3,90.17 | 102.87,90.17 114.3,90.17 | DIS1.2 128.27,91.44 127,90.17 114.3,90.17
  Bottom 0.508: U$7.5 151.13,96.52 130.81,96.52 128.27,93.98 DIS1.2
N$58
  Top 0.508: DIS4.4 95.25,93.98 96.52,95.25 107.95,95.25 | DIS3.4 107.95,95.25 | 120.65,93.98 119.38,95.25 107.95,95.25 | 120.65,93.98 121.92,95.25 133.35,95.25 DIS1.4 | 120.65,93.98 DIS2.4
  Bottom 0.508: DIS1.4 133.35,95.25 152.4,95.25 U$7.4
N$59  (via drill 0.61)
  Top 0.508: U$7.3 153.67,93.98 152.4,93.98 135.89,110.49 | DIS4.6 97.79,109.22 105.41,116.84 110.49,116.84 DIS3.6 | DIS2.6 123.19,109.22 130.81,116.84 | 130.81,116.84 135.89,116.84 135.89,110.49 | DIS1.6 135.89,110.49 | v127,123.19 130.81,119.38 130.81,116.84
  Bottom 0.406: DIS4.6 97.79,111.76 102.87,116.84 102.87,120.65 101.6,121.92 100.33,121.92 99.06,123.19 100.33,124.46 101.6,124.46 102.87,123.19
  Bottom 0.508: v127,123.19 102.87,123.19
N$60
  Top 0.508: DIS3.7 107.95,106.68 109.22,105.41 120.65,105.41 | DIS2.7 120.65,105.41 | DIS1.7 133.35,106.68 132.08,105.41 | 120.65,105.41 132.08,105.41 | U$7.2 138.43,92.71 138.43,99.06 132.08,105.41
N$61
  Top 0.508: T2.2 120.65,115.57 121.92,116.84 U$8.8
N$62
  Bottom 0.508: 97.79,67.31 92.71,67.31 90.17,69.85 S16.1 88.9,69.85 85.09,69.85 85.09,54.61 U$9.3 | 97.79,67.31 100.33,69.85 S15.1 | 109.22,67.31 111.76,69.85 S14.1 | 97.79,67.31 109.22,67.31 | 120.65,67.31 123.19,69.85 S13.1 | 109.22,67.31 120.65,67.31 | 132.08,67.31 134.62,69.85 S12.1 | 120.65,67.31 132.08,67.31 | 143.51,67.31 146.05,69.85 S11.1 | 132.08,67.31 143.51,67.31 | 154.94,67.31 157.48,69.85 S10.1 | 143.51,67.31 154.94,67.31 | 154.94,67.31 166.37,67.31 168.91,69.85 S9.1
N$63  (via drill 0.61)
  Top 0.508: 172.72,17.78 172.72,13.97 175.26,11.43 S57.4 | 172.72,17.78 175.26,20.32 S49.4 | 172.72,26.67 175.26,29.21 S41.4 | 172.72,17.78 172.72,26.67 | 172.72,35.56 175.26,38.1 S33.4 | 172.72,26.67 172.72,35.56 | 172.72,44.45 175.26,46.99 S25.4 | 172.72,35.56 172.72,44.45 | 172.72,53.34 175.26,55.88 S17.4 | 172.72,44.45 172.72,53.34 | 172.72,62.23 175.26,64.77 S9.4 | 172.72,53.34 172.72,62.23 | 172.72,71.12 175.26,73.66 S1.4 | 172.72,62.23 172.72,71.12 | v165.1,86.36 172.72,78.74 172.72,71.12
  Bottom 0.508: U$10.2 147.32,86.36 v165.1,86.36
N$64
  Top 0.508: 161.29,17.78 161.29,13.97 163.83,11.43 S58.4 | 161.29,17.78 163.83,20.32 S50.4 | 161.29,26.67 163.83,29.21 S42.4 | 161.29,17.78 161.29,26.67 | 161.29,35.56 163.83,38.1 S34.4 | 161.29,26.67 161.29,35.56 | 161.29,44.45 163.83,46.99 S26.4 | 161.29,35.56 161.29,44.45 | 161.29,53.34 163.83,55.88 S18.4 | 161.29,44.45 161.29,53.34 | 161.29,62.23 163.83,64.77 S10.4 | 161.29,53.34 161.29,62.23 | 161.29,62.23 161.29,71.12 163.83,73.66 S2.4
  Bottom 0.508: U$10.3 144.78,81.28 158.75,81.28 160.02,82.55 168.91,82.55 172.72,78.74 172.72,76.2 167.64,76.2 165.1,73.66 S2.4
N$65
  Top 0.508: 149.86,17.78 149.86,13.97 152.4,11.43 S59.4 | 149.86,17.78 152.4,20.32 S51.4 | 149.86,26.67 152.4,29.21 S43.4 | 149.86,17.78 149.86,26.67 | 149.86,35.56 152.4,38.1 S35.4 | 149.86,26.67 149.86,35.56 | 149.86,44.45 152.4,46.99 S27.4 | 149.86,35.56 149.86,44.45 | 149.86,53.34 152.4,55.88 S19.4 | 149.86,44.45 149.86,53.34 | 149.86,62.23 152.4,64.77 S11.4 | 149.86,53.34 149.86,62.23 | 149.86,62.23 149.86,71.12 152.4,73.66 S3.4 153.67,73.66 153.67,76.2 160.02,76.2 161.29,77.47 161.29,86.36 142.24,86.36 U$10.4
N$67
  Top 0.508: 138.43,17.78 138.43,13.97 140.97,11.43 S60.4 | 138.43,17.78 140.97,20.32 S52.4 | 138.43,26.67 140.97,29.21 S44.4 | 138.43,17.78 138.43,26.67 | 138.43,35.56 140.97,38.1 S36.4 | 138.43,26.67 138.43,35.56 | 138.43,44.45 140.97,46.99 S28.4 | 138.43,35.56 138.43,44.45 | 138.43,53.34 140.97,55.88 S20.4 | 138.43,44.45 138.43,53.34 | 138.43,62.23 140.97,64.77 S12.4 | 138.43,53.34 138.43,62.23 | 138.43,62.23 138.43,71.12 140.97,73.66 S4.4 142.24,73.66 142.24,76.2 148.59,76.2 149.86,77.47 149.86,81.28 139.7,81.28 U$10.5
N$68
  Top 0.508: 127,17.78 127,13.97 129.54,11.43 S61.4 | 127,17.78 129.54,20.32 S53.4 | 127,26.67 129.54,29.21 S45.4 | 127,17.78 127,26.67 | 127,35.56 129.54,38.1 S37.4 | 127,26.67 127,35.56 | 127,44.45 129.54,46.99 S29.4 | 127,35.56 127,44.45 | 127,53.34 129.54,55.88 S21.4 | 127,44.45 127,53.34 | 127,62.23 129.54,64.77 S13.4 | 127,53.34 127,62.23 | 127,62.23 127,71.12 129.54,73.66 S5.4 130.81,73.66 130.81,76.2 137.16,76.2 138.43,77.47 138.43,80.01 U$10.6
N$69
  Top 0.508: 115.57,17.78 115.57,13.97 118.11,11.43 S62.4 | 115.57,17.78 118.11,20.32 S54.4 | 115.57,26.67 118.11,29.21 S46.4 | 115.57,17.78 115.57,26.67 | 115.57,35.56 118.11,38.1 S38.4 | 115.57,26.67 115.57,35.56 | 115.57,44.45 118.11,46.99 S30.4 | 115.57,35.56 115.57,44.45 | 115.57,53.34 118.11,55.88 S22.4 | 115.57,44.45 115.57,53.34 | 115.57,62.23 118.11,64.77 S14.4 | 115.57,53.34 115.57,62.23 | 115.57,62.23 115.57,71.12 118.11,73.66 S6.4 119.38,73.66 119.38,76.2 125.73,76.2 127,77.47 127,78.74 U$10.7
N$70
  Top 0.508: 104.14,17.78 104.14,13.97 106.68,11.43 S63.4 | 104.14,17.78 106.68,20.32 S55.4 | 104.14,26.67 106.68,29.21 S47.4 | 104.14,17.78 104.14,26.67 | 104.14,35.56 106.68,38.1 S39.4 | 104.14,26.67 104.14,35.56 | 104.14,44.45 106.68,46.99 S31.4 | 104.14,35.56 104.14,44.45 | 104.14,53.34 106.68,55.88 S23.4 | 104.14,44.45 104.14,53.34 | 104.14,62.23 106.68,64.77 S15.4 | 104.14,53.34 104.14,62.23 | 104.14,71.12 106.68,73.66 S7.4 | 104.14,62.23 104.14,71.12 | U$10.8 127,81.28 104.14,81.28 104.14,71.12
N$71
  Top 0.508: 92.71,17.78 92.71,13.97 95.25,11.43 S64.4 | 92.71,17.78 95.25,20.32 S56.4 | 92.71,26.67 95.25,29.21 S48.4 | 92.71,17.78 92.71,26.67 | 92.71,35.56 95.25,38.1 S40.4 | 92.71,26.67 92.71,35.56 | 92.71,44.45 95.25,46.99 S32.4 | 92.71,35.56 92.71,44.45 | 92.71,53.34 95.25,55.88 S24.4 | 92.71,44.45 92.71,53.34 | 92.71,62.23 95.25,64.77 S16.4 | 92.71,53.34 92.71,62.23 | 92.71,62.23 92.71,71.12 95.25,73.66 S8.4
  Bottom 0.508: U$10.9 124.46,81.28 95.25,81.28 92.71,78.74 92.71,73.66 95.25,73.66 S8.4
N$72
  Bottom 0.508: 97.79,58.42 92.71,58.42 90.17,60.96 S24.1 88.9,60.96 86.36,60.96 86.36,53.34 U$9.4 | 97.79,58.42 100.33,60.96 S23.1 | 109.22,58.42 111.76,60.96 S22.1 | 97.79,58.42 109.22,58.42 | 120.65,58.42 123.19,60.96 S21.1 | 109.22,58.42 120.65,58.42 | 132.08,58.42 134.62,60.96 S20.1 | 120.65,58.42 132.08,58.42 | 143.51,58.42 146.05,60.96 S19.1 | 132.08,58.42 143.51,58.42 | 154.94,58.42 157.48,60.96 S18.1 | 143.51,58.42 154.94,58.42 | 154.94,58.42 166.37,58.42 168.91,60.96 S17.1
N$73
  Bottom 0.508: 86.36,49.53 82.55,45.72 U$9.5 | 86.36,49.53 88.9,52.07 S32.1 | 97.79,49.53 100.33,52.07 S31.1 | 86.36,49.53 97.79,49.53 | 109.22,49.53 111.76,52.07 S30.1 | 97.79,49.53 109.22,49.53 | 120.65,49.53 123.19,52.07 S29.1 | 109.22,49.53 120.65,49.53 | 132.08,49.53 134.62,52.07 S28.1 | 120.65,49.53 132.08,49.53 | 143.51,49.53 146.05,52.07 S27.1 | 132.08,49.53 143.51,49.53 | 154.94,49.53 157.48,52.07 S26.1 | 143.51,49.53 154.94,49.53 | 154.94,49.53 166.37,49.53 168.91,52.07 S25.1
N$74
  Top 0.508: U$9.6 88.9,43.18 S40.1
  Bottom 0.508: 104.14,40.64 101.6,43.18 S39.1 | 109.22,40.64 104.14,40.64 | 109.22,40.64 111.76,43.18 S38.1 | 120.65,40.64 123.19,43.18 S37.1 | 109.22,40.64 120.65,40.64 | 132.08,40.64 134.62,43.18 S36.1 | 120.65,40.64 132.08,40.64 | 143.51,40.64 146.05,43.18 S35.1 | 132.08,40.64 143.51,40.64 | 154.94,40.64 157.48,43.18 S34.1 | 143.51,40.64 154.94,40.64 | 154.94,40.64 166.37,40.64 168.91,43.18 S33.1 | 104.14,40.64 92.71,40.64 90.17,43.18 S40.1
N$75
  Bottom 0.508: U$9.7 82.55,40.64 88.9,34.29 S48.1 90.17,34.29 92.71,31.75 104.14,31.75 | 104.14,31.75 101.6,34.29 S47.1 | 109.22,31.75 104.14,31.75 | 109.22,31.75 111.76,34.29 S46.1 | 120.65,31.75 123.19,34.29 S45.1 | 109.22,31.75 120.65,31.75 | 132.08,31.75 134.62,34.29 S44.1 | 120.65,31.75 132.08,31.75 | 143.51,31.75 146.05,34.29 S43.1 | 132.08,31.75 143.51,31.75 | 154.94,31.75 157.48,34.29 S42.1 | 143.51,31.75 154.94,31.75 | 154.94,31.75 166.37,31.75 168.91,34.29 S41.1
N$77
  Bottom 0.508: 97.79,22.86 92.71,22.86 90.17,25.4 S56.1 88.9,25.4 86.36,25.4 86.36,33.02 U$9.8 | 97.79,22.86 100.33,25.4 S55.1 | 109.22,22.86 111.76,25.4 S54.1 | 97.79,22.86 109.22,22.86 | 120.65,22.86 123.19,25.4 S53.1 | 109.22,22.86 120.65,22.86 | 132.08,22.86 134.62,25.4 S52.1 | 120.65,22.86 132.08,22.86 | 143.51,22.86 146.05,25.4 S51.1 | 132.08,22.86 143.51,22.86 | 154.94,22.86 157.48,25.4 S50.1 | 143.51,22.86 154.94,22.86 | 154.94,22.86 166.37,22.86 168.91,25.4 S49.1
N$78
  Top 0.508: U$9.9 86.36,30.48 86.36,19.05 88.9,16.51 S64.1
  Bottom 0.508: 97.79,13.97 92.71,13.97 90.17,16.51 S64.1 | 97.79,13.97 100.33,16.51 S63.1 | 109.22,13.97 111.76,16.51 S62.1 | 97.79,13.97 109.22,13.97 | 120.65,13.97 123.19,16.51 S61.1 | 109.22,13.97 120.65,13.97 | 132.08,13.97 134.62,16.51 S60.1 | 120.65,13.97 132.08,13.97 | 143.51,13.97 146.05,16.51 S59.1 | 132.08,13.97 143.51,13.97 | 154.94,13.97 157.48,16.51 S58.1 | 143.51,13.97 154.94,13.97 | 154.94,13.97 166.37,13.97 168.91,16.51 S57.1
VCC
  Bottom 0.406: U$2.10 IC1.40 46.99,78.74 46.99,55.88 | 46.99,55.88 IC1.31 | 46.99,55.88 46.99,50.8 IC1.29 50.8,50.8 53.34,53.34 66.04,53.34 69.85,49.53 69.85,33.02 U$5.10
  Bottom 0.508: 34.29,87.63 31.75,85.09 U$3.10 | 34.29,87.63 38.1,91.44 X1.15 38.1,92.71 38.1,93.98 39.37,95.25 68.58,95.25 71.12,92.71 X1.2 | 34.29,87.63 43.18,78.74 IC1.40
  pour Top: -1.27,127 181.61,127 181.61,-1.27 -1.27,-1.27

### Text on the board
Bottom: OPENDCLABS TK1V1